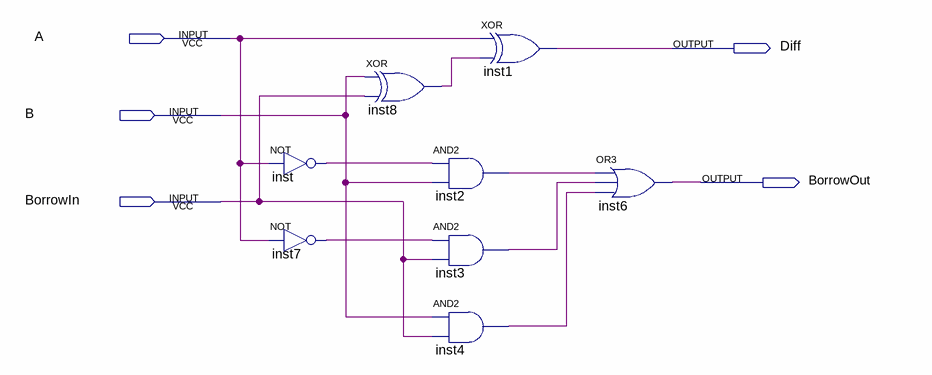
[diagram p0: schematic sheet]
// Quartus schematic subtrator_1bit.bdf as structural Verilog: 8 symbols, 5 pins
module subtrator_1bit (
  input  A,
  input  B,
  input  BorrowIn,
  output Diff,
  output BorrowOut
);

  wire inst2_out, inst3_out, inst4_out, inst7_out, inst8_out, inst_out;

  not inst (inst_out, A);
  not inst7 (inst7_out, A);
  xor inst8 (inst8_out, B, BorrowIn);
  and inst2 (inst2_out, inst_out, B);
  and inst3 (inst3_out, inst7_out, BorrowIn);
  and inst4 (inst4_out, B, BorrowIn);
  xor inst1 (Diff, A, inst8_out);
  or inst6 (BorrowOut, inst2_out, inst3_out, inst4_out);
endmodule
